# Altium schematic sheet CPLD.SchDoc: CPLD
size A4; DocumentNumber: 4; SheetNumber: 4; SheetTotal: 5
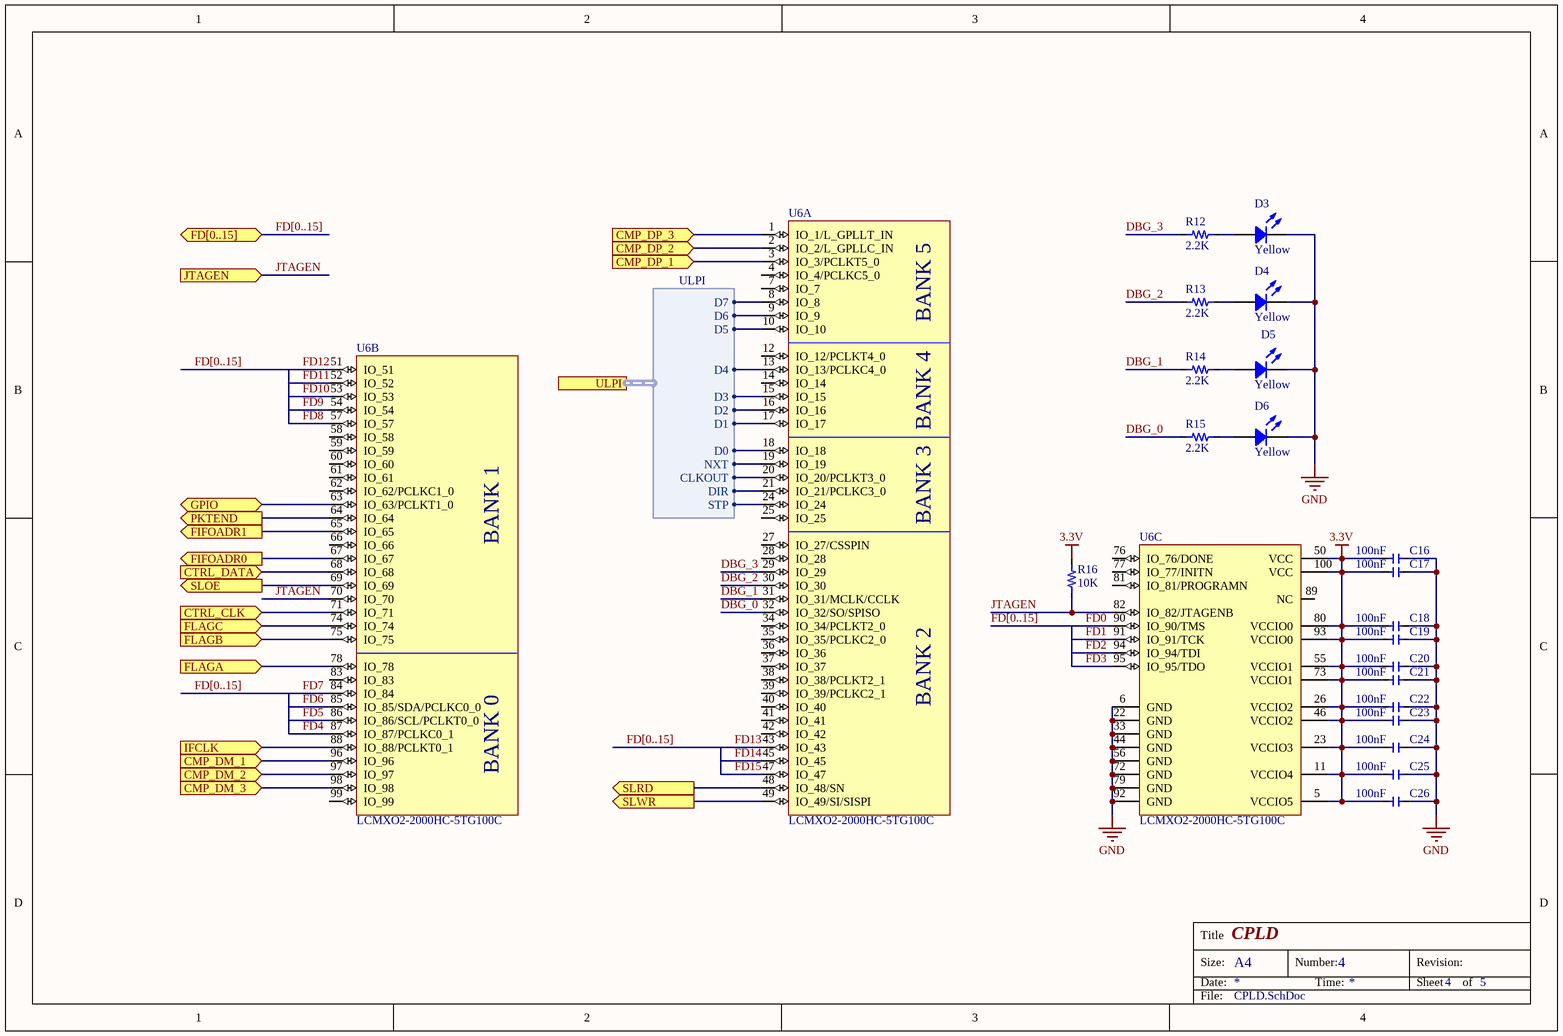
[diagram p0: CPLD.SchDoc]

## Parts
C16  100nF  [CAP 0402/1005]
C17  100nF  [CAP 0402/1005]
C18  100nF  [CAP 0402/1005]
C19  100nF  [CAP 0402/1005]
C20  100nF  [CAP 0402/1005]
C21  100nF  [CAP 0402/1005]
C22  100nF  [CAP 0402/1005]
C23  100nF  [CAP 0402/1005]
C24  100nF  [CAP 0402/1005]
C25  100nF  [CAP 0402/1005]
C26  100nF  [CAP 0402/1005]
D3  Yellow  [LED 0603/1608 YELLOW]
D4  Yellow  [LED 0603/1608 YELLOW]
D5  Yellow  [LED 0603/1608 YELLOW]
D6  Yellow  [LED 0603/1608 YELLOW]
R12  2.2K  [RES 0402/1005]
R13  2.2K  [RES 0402/1005]
R14  2.2K  [RES 0402/1005]
R15  2.2K  [RES 0402/1005]
R16  10K  [RES 0402/1005]
U6  LCMXO2-2000HC-5TG100C  [NXP LQFP-100 14x14mm]  (parts A,B,C of 3)

## Ports
CMP_DM_1 (in), CMP_DM_2 (in), CMP_DM_3 (in), CMP_DP_1 (in), CMP_DP_2 (in), CMP_DP_3 (in), CTRL_CLK (in), CTRL_DATA (in), FD[0..15] (bidir), FIFOADR0 (out), FIFOADR1 (out), FLAGA (in), FLAGB (in), FLAGC (in), GPIO (bidir), IFCLK (in), JTAGEN (in), PKTEND (out), SLOE (out), SLRD (out), SLWR (out), ULPI (harness ULPI)

## Harnesses
ULPI: CLKOUT, D0, D1, D2, D3, D4, D5, D6, D7, DIR, NXT, STP

## Nets
3.3V: C16.1 C17.2 C18.1 C19.1 C20.1 C21.1 C22.1 C23.1 C24.1 C25.1 C26.1 R16.2 U6.5(VCCIO5) U6.11(VCCIO4) U6.23(VCCIO3) U6.26(VCCIO2) U6.46(VCCIO2) U6.50(VCC) U6.55(VCCIO1) U6.73(VCCIO1) U6.80(VCCIO0) U6.93(VCCIO0) U6.100(VCC)
GND: C16.2 C17.1 C18.2 C19.2 C20.2 C21.2 C22.2 C23.2 C24.2 C25.2 C26.2 D3.2 D4.2 D5.2 D6.2 U6.6(GND) U6.22(GND) U6.33(GND) U6.44(GND) U6.56(GND) U6.72(GND) U6.79(GND) U6.92(GND)
CMP_DM_1: U6.96(IO_96) ; port CMP_DM_1
CMP_DM_2: U6.97(IO_97) ; port CMP_DM_2
CMP_DM_3: U6.98(IO_98) ; port CMP_DM_3
CMP_DP_1: U6.3(IO_3/PCLKT5_0) ; port CMP_DP_1
CMP_DP_2: U6.2(IO_2/L_GPLLC_IN) ; port CMP_DP_2
CMP_DP_3: U6.1(IO_1/L_GPLLT_IN) ; port CMP_DP_3
CTRL_CLK: U6.71(IO_71) ; port CTRL_CLK
CTRL_DATA: U6.68(IO_68) ; port CTRL_DATA
DBG_0: R15.2 U6.32(IO_32/SO/SPISO)
DBG_1: R14.2 U6.31(IO_31/MCLK/CCLK)
DBG_2: R13.2 U6.30(IO_30)
DBG_3: R12.2 U6.29(IO_29)
FD0: U6.90(IO_90/TMS)
FD1: U6.91(IO_91/TCK)
FD2: U6.94(IO_94/TDI)
FD3: U6.95(IO_95/TDO)
FD4: U6.87(IO_87/PCLKC0_1)
FD5: U6.86(IO_86/SCL/PCLKT0_0)
FD6: U6.85(IO_85/SDA/PCLKC0_0)
FD7: U6.84(IO_84)
FD8: U6.57(IO_57)
FD9: U6.54(IO_54)
FD10: U6.53(IO_53)
FD11: U6.52(IO_52)
FD12: U6.51(IO_51)
FD13: U6.43(IO_43)
FD14: U6.45(IO_45)
FD15: U6.47(IO_47)
FIFOADR0: U6.67(IO_67) ; port FIFOADR0
FIFOADR1: U6.65(IO_65) ; port FIFOADR1
FLAGA: U6.78(IO_78) ; port FLAGA
FLAGB: U6.75(IO_75) ; port FLAGB
FLAGC: U6.74(IO_74) ; port FLAGC
GPIO: U6.63(IO_63/PCLKT1_0) ; port GPIO
IFCLK: U6.88(IO_88/PCLKT0_1) ; port IFCLK
JTAGEN: R16.1 U6.70(IO_70) U6.82(IO_82/JTAGENB) ; port JTAGEN
PKTEND: U6.64(IO_64) ; port PKTEND
SLOE: U6.69(IO_69) ; port SLOE
SLRD: U6.48(IO_48/SN) ; port SLRD
SLWR: U6.49(IO_49/SI/SISPI) ; port SLWR
NetD3_1: D3.1 R12.1
NetD4_1: D4.1 R13.1
NetD5_1: D5.1 R14.1
NetD6_1: D6.1 R15.1
NetU6_8: U6.8(IO_8) ; port ULPI.D7
NetU6_9: U6.9(IO_9) ; port ULPI.D6
NetU6_10: U6.10(IO_10) ; port ULPI.D5
NetU6_13: U6.13(IO_13/PCLKC4_0) ; port ULPI.D4
NetU6_15: U6.15(IO_15) ; port ULPI.D3
NetU6_16: U6.16(IO_16) ; port ULPI.D2
NetU6_17: U6.17(IO_17) ; port ULPI.D1
NetU6_18: U6.18(IO_18) ; port ULPI.D0
NetU6_19: U6.19(IO_19) ; port ULPI.NXT
NetU6_20: U6.20(IO_20/PCLKT3_0) ; port ULPI.CLKOUT
NetU6_21: U6.21(IO_21/PCLKC3_0) ; port ULPI.DIR
NetU6_24: U6.24(IO_24) ; port ULPI.STP

Not connected (* = marked no-connect by the designer): U6 4(IO_4/PCLKC5_0) 7(IO_7) 12(IO_12/PCLKT4_0) 14(IO_14) 25(IO_25) 27(IO_27/CSSPIN) 28(IO_28) 34(IO_34/PCLKT2_0) 35(IO_35/PCLKC2_0) 36(IO_36) 37(IO_37) 38(IO_38/PCLKT2_1) 39(IO_39/PCLKC2_1) 40(IO_40) 41(IO_41) 42(IO_42) 58(IO_58) 59(IO_59) 60(IO_60) 61(IO_61) 62(IO_62/PCLKC1_0) 66(IO_66) 76(IO_76/DONE) 77(IO_77/INITN) 81(IO_81/PROGRAMN) 83(IO_83) 89(NC) 99(IO_99)

## Buses and harness runs
bus FD[0..15]
bus FD[0..15] = port FD[0..15]

## Notes on the sheet
- Title
- Size:
- Date:
- A4
- Number:
- Time:
- Revision:
- Sheet
- of
- File:
- (in symbol UFL004, part A) BANK 5; BANK 4; BANK 3; BANK 2
- (in symbol UFL004, part B) BANK 1; BANK 0

## Library data of the parts
C16-C26 = CM0464: CAP CER 100NF 25V X5R 0402; Part Number: GRM155R61E104KA87D; Manufacturer: Murata; TemperatureRange: -55C ~ 85C; Tolerance: 10%; Value: 100nF; PartId: CM0464; Supplier 1: Digi-Key; Supplier Part Number 1: 490-5920-2-ND; ComponentLink1Description: Datasheet; ComponentLink1URL: http://www.murata.com/~/media/webrenewal/support/library/catalog/products/capacitor/mlcc/c02e.pdf; ComponentLink2Description: Digi-Key Listing; ComponentLink2URL: https://www.digikey.com/product-detail/en/murata-electronics-north-america/GRM155R61E104KA87D/490-5920-2-ND/3693681; TemperatureCoefficient: X5R; Voltage: 25V; Price: 0.0048; Device Package: 0402 (1005 Metric)
D3-D6 = LS0046: LED YELLOW CLEAR 0603 SMD; Part Number: LTST-C191KSKT; Manufacturer: Lite-On Inc.; Value: Green; Type: Surface Mount; Millicandela: 104mcd; Voltage Forward: 2.1V; Current (Test): 20mA; Viewing Angle: 130; Colour: Yellow; PartId: LS0046; Supplier 1: Digi-Key; Supplier Part Number 1: 160-1448-2-ND; ComponentLink1Description: Datasheet; ComponentLink1URL: http://optoelectronics.liteon.com/upload/download/DS22-2000-224/LTST-C191KSKT.pdf; ComponentLink2Description: Digi-Key Listing; ComponentLink2URL: http://www.digikey.ca/product-detail/en/LTST-C191KSKT/160-1448-2-ND/386839; Price: 0.0555; Device Package: 0603 (1608 Metric); Lens Transparency: Clear
R12-R15 = RC1434: RES SMD 2.2K OHM 1% 1/16W 0402; Part Number: RC0402FR-072K2L; Manufacturer: Yageo; TemperatureRange: -55C ~ 155C; TemperatureCoefficient: 100ppm/C; PowerRating: 0.0625W, 1/16W; PartId: RC1434; Value: 2.2K; Supplier 1: Mouser; Supplier Part Number 1: 603-RC0402FR-072K2L; ComponentLink1Description: Datasheet; ComponentLink1URL: http://www.yageo.com/NewPortal/yageodocoutput?fileName=/pdf/R-Chip/PYu-RC_Group_51_RoHS_L_9.pdf; Tolerance: 1%; Price: 0.0043; Type: Thick Film; Device Package: 0402 (1005 Metric)
R16 = RC1531: RES SMD 10K OHM 1% 1/16W 0402; Part Number: RC0402FR-0710KL; Manufacturer: Yageo; TemperatureRange: -55C ~ 155C; TemperatureCoefficient: 100ppm/C; PowerRating: 0.0625W, 1/16W; PartId: RC1531; Value: 10K; Supplier 1: Mouser; Supplier Part Number 1: 603-RC0402FR-0710KL; ComponentLink1Description: Datasheet; ComponentLink1URL: http://www.yageo.com/NewPortal/yageodocoutput?fileName=/pdf/R-Chip/PYu-RC_Group_51_RoHS_L_9.pdf; Tolerance: 1%; Price: 0.0043; Type: Thick Film; Device Package: 0402 (1005 Metric)
U6 = UFL004: FPGA, MACHXO2, 2112 LUTs; Manufacturer: Lattice; PartId: UFL004; Part Number: LCMXO2-2000HC-5TG100C; Supplier 1: Digi-Key; Supplier Part Number 1: LCMXO2-2000HC-5TG100C-ND; Supplier 2: Mouser; Supplier Part Number 2: 842-XO22000HC5TG100C; ComponentLink1Description: Datasheet; ComponentLink1URL: https://www.latticesemi.com/view_document?document_id=38834; Price: 16; Type: FPGA; Device Package: 100-TQFP (14x14); Operating Temperature: -0C ~ 85C